# EAGLE schematic CTRL_PANEL (EAGLE 7.7.0)
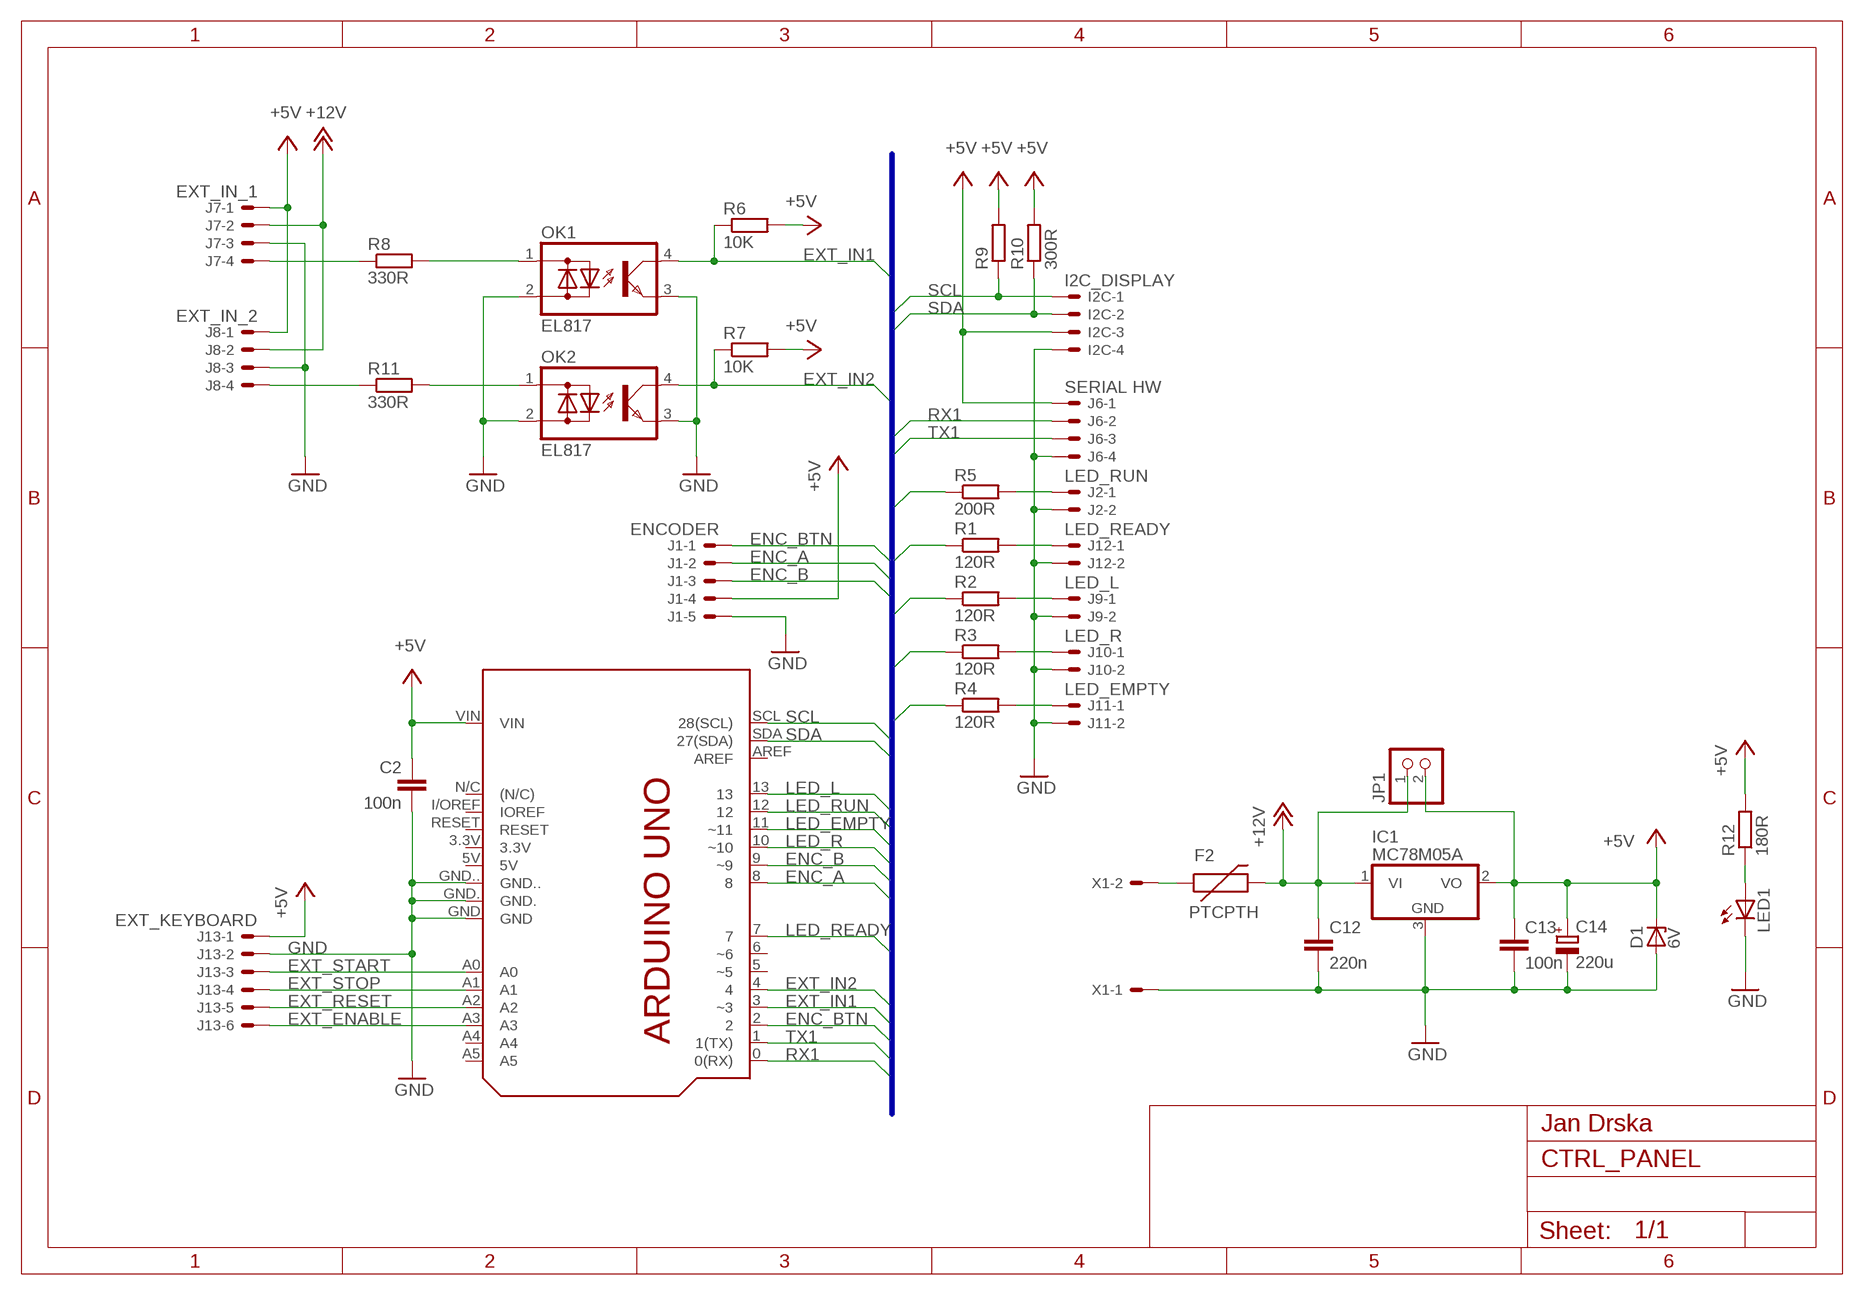
[diagram p0: schematic, sheet 1]

## Parts
C2  100n  C-EUC0603  [C0603]
C12  220n  C-EUC0603  [C0603]
C13  100n  C-EUC0603  [C0603]
C14  220u  CPOL-EUE2,5-6E  [E2,5-6E]
D1  6V  ZENER-DIODESMB  [SMB]
F2  PTCPTH  [PTC]
I2C  I2C_DISPLAY  22-27-2041-04  [6410-04]
IC1  MC78M05A  7808DT  [TO252]
J1  ENCODER  22-27-2051-05  [6410-05]
J2  LED_RUN  22-27-2021-02  [6410-02]
J6  SERIAL HW  22-27-2041-04  [6410-04]
J7  EXT_IN_1  22-27-2041-04  [6410-04]
J8  EXT_IN_2  22-27-2041-04  [6410-04]
J9  LED_L  22-27-2021-02  [6410-02]
J10  LED_R  22-27-2021-02  [6410-02]
J11  LED_EMPTY  22-27-2021-02  [6410-02]
J12  LED_READY  22-27-2021-02  [6410-02]
J13  EXT_KEYBOARD  22-27-2061-06  [6410-06]
JP1  PINHD-1X2  [1X02]
LED1  LEDCHIP-LED0603  [CHIP-LED0603]
OK1  EL817  PC814  [DIL04]
OK2  EL817  PC814  [DIL04]
PCB1  ARDUINO_UNO  [ARDUINO_UNO]
R1  120R  R-EU_R0603  [R0603]
R2  120R  R-EU_R0603  [R0603]
R3  120R  R-EU_R0603  [R0603]
R4  120R  R-EU_R0603  [R0603]
R5  200R  R-EU_R0603  [R0603]
R6  10K  R-EU_R0603  [R0603]
R7  10K  R-EU_R0603  [R0603]
R8  330R  R-EU_R0603  [R0603]
R9  R-EU_R0603  [R0603]
R10  300R  R-EU_R0603  [R0603]
R11  330R  R-EU_R0603  [R0603]
R12  180R  R-EU_R0603  [R0603]
X1  22-23-2021  [22-23-2021]

## Nets
+5V: C2.1 C13.1 C14.+ D1.C I2C.3 IC1.2(VO) J1.4 J6.1 J7.1 J8.1 J13.1 JP1.2 PCB1.VIN R6.2 R7.2 R9.2 R10.2 R12.2
+12V: C12.1 F2.P$2 IC1.1(VI) J7.2 J8.2 JP1.1
ENC_A: J1.2 PCB1.8
ENC_B: J1.3 PCB1.9(~9)
ENC_BTN: J1.1 PCB1.2
EXT_ENABLE: J13.6 PCB1.A3
EXT_IN1: OK1.4(C) PCB1.3(~3) R6.1
EXT_IN2: OK2.4(C) PCB1.4 R7.1
EXT_RESET: J13.5 PCB1.A2
EXT_START: J13.3 PCB1.A0
EXT_STOP: J13.4 PCB1.A1
GND: C2.2 C12.2 C13.2 C14.- D1.A I2C.4 IC1.3(GND) J1.5 J2.2 J6.4 J7.3 J8.3 J9.2 J10.2 J11.2 J12.2 J13.2 LED1.C OK1.2(AC2) OK1.3(E) OK2.2(AC2) OK2.3(E) PCB1.GND PCB1.GND. PCB1.GND.. X1.1
LED_EMPTY: PCB1.11(~11) R4.1
LED_L: PCB1.13 R2.1
LED_R: PCB1.10(~10) R3.1
LED_READY: PCB1.7 R1.1
LED_RUN: PCB1.12 R5.1
N$2: J12.1 R1.2
N$3: J2.1 R5.2
N$4: J9.1 R2.2
N$5: J10.1 R3.2
N$6: J11.1 R4.2
N$8: F2.P$1 X1.2
N$9: J7.4 R8.1
N$10: J8.4 R11.1
N$11: LED1.A R12.1
N$15: OK2.1(AC1) R11.2
N$18: OK1.1(AC1) R8.2
RX1: J6.2 PCB1.0(0(RX))
SCL: I2C.1 PCB1.SCL(28(SCL)) R9.1
SDA: I2C.2 PCB1.SDA(27(SDA)) R10.1
TX1: J6.3 PCB1.1(1(TX))
Unconnected: PCB1.3.3V PCB1.5(~5) PCB1.5V PCB1.6(~6) PCB1.A4 PCB1.A5 PCB1.AREF PCB1.I/OREF(IOREF) PCB1.N/C((N/C)) PCB1.RESET

## Buses
SDA,SCL,ENC_A,ENC_B,ENC_BTN,RX2,TX2,LED_RUN,EXT_IN1,EXT_IN2,LED_READY,LED_L,LED_R,LED_EMPTY,EXT_START,RX1,TX1,EXT_STOP,EXT_RESET,EXT_ENABLE

## Library data of the parts
C2 C12 C13 = rcl:C-EU: CAPACITOR, European symbol
C14 = rcl:CPOL-EU: POLARIZED CAPACITOR, European symbol
D1 = diode:ZENER-DIODE: Z-Diode
F2 = SparkFun:PTC: Resettable Fuse PTC Resettable Fuse. Spark Fun Electronics SKU : COM-08357
I2C J6-J8 = con-molex:22-?-04: CONNECTOR wire to board 2.54 mm (.1 inch) pitch header; OC_FARNELL: unknown; OC_NEWARK: unknown
IC1 = linear:78*: Positive VOLTAGE REGULATOR Source: http://cache.national.com/ds/LM/LM78L05.pdf http://www.fairchildsemi.com/ds/LM/LM7805.pdf
J1 = con-molex:22-?-05: CONNECTOR wire to board 2.54 mm (.1 inch) pitch header; OC_FARNELL: unknown; OC_NEWARK: unknown
J2 J9-J12 = con-molex:22-?-02: CONNECTOR wire to board 2.54 mm (.1 inch) pitch header; OC_FARNELL: unknown; OC_NEWARK: unknown
J13 = con-molex:22-?-06: CONNECTOR wire to board 2.54 mm (.1 inch) pitch header; OC_FARNELL: unknown; OC_NEWARK: unknown
JP1 = pinhead:PINHD-1X2: PIN HEADER
LED1 = led:LED: LED OSRAM: - CHIPLED LG R971, LG N971, LY N971, LG Q971, LY Q971, LO R971, LY R971 LH N974, LH R974 LS Q976, LO Q976, LY Q976 LO Q996 - Hyper CHIPLED LW Q18S LB Q993, LB Q99A, LB R99A - SideLED LS A670, LO A670, LY A670, LG A670, LP A670 LB A673, LV A673, LT A673, LW A673 LH A674 LY A675 LS A676, LA A676, LO A676, LY A676, LW A676 LS A679, LY A679, LG A679 - Hyper Micro SIDELED® LS Y876, LA Y876, LO Y876, LY Y876 LT Y87S - SmartLED LW L88C, LW L88S LB L89C, LB L89S, LG L890 LS L89K, LO L89K, LY L89K LS L896, LA L896, LO L896, LY L896 - TOPLED LS T670, LO T670, LY T670, LG T670, LP T670 LSG T670, LSP T670, LSY T670, LOP T670, LYG T670 LG T671, LOG T671, LSG T671 LB T673, LV T673, LT T673, LW T673 LH T674 LS T676, LA T676, LO T676, LY T676, LB T676, LH T676, LSB T676, LW T676 LB T67C, LV T67C, LT T67C, LS T67K, LO T67K, LY T67K, LW E67C LS E67B, LA E67B, LO E67B, LY E67B, LB E67C, LV E67C, LT E67C LW T67C LS T679, LY T679, LG T679 LS T770, LO T770, LY T770, LG T770, LP T770 LB T773, LV T773, LT T773, LW T773 LH T774 LS E675, LA E675, LY E675, LS T675 LS T776, LA T776, LO T776, LY T776, LB T776 LHGB T686 LT T68C, LB T68C - Hyper Mini TOPLED® LB M676 - Mini TOPLED Santana® LG M470 LS M47K, LO M47K, LY M47K Source: http://www.osram.convergy.de LUXEON: - LUMILED® LXK2-PW12-R00, LXK2-PW12-S00, LXK2-PW14-U00, LXK2-PW14-V00 LXK2-PM12-R00, LXK2-PM12-S00, LXK2-PM14-U00 LXK2-PE12-Q00, LXK2-PE12-R00, LXK2-PE12-S00, LXK2-PE14-T00, LXK2-PE14-U00 LXK2-PB12-K00, LXK2-PB12-L00, LXK2-PB12-M00, LXK2-PB14-N00, LXK2-PB14-P00, LXK2-PB14-Q00 LXK2-PR12-L00, LXK2-PR12-M00, LXK2-PR14-Q00, LXK2-PR14-R00 LXK2-PD12-Q00, LXK2-PD12-R00, LXK2-PD12-S00 LXK2-PH12-R00, LXK2-PH12-S00 LXK2-PL12-P00, LXK2-PL12-Q00, LXK2-PL12-R00 Source: www.luxeon.com KINGBRIGHT: KA-3528ASYC Source: www.kingbright.com
OK1 OK2 = optocoupler:PC814: SHARP OPTO COUPLER; OC_FARNELL: 9707662; OC_NEWARK: unknown
PCB1 = E14_Arduino_revC:ARDUINO_UNO: Device for representing an Arduino Uno board with a footprint in an EAGLE design. Created by Dave Young for Element14. More EAGLE documentation at: http://www.element14.com/community/community/knode/cadsoft_eagle
R1-R12 = rcl:R-EU_: RESISTOR, European symbol
X1 = con-molex:22-23-2021: .100" (2.54mm) Center Header - 2 Pin; MF: MOLEX; MPN: 22-23-2021; OC_FARNELL: 1462926; OC_NEWARK: 25C3832